# Altium schematic sheet Charging&1AOut2.SchDoc
size A; DocumentNumber: 5; SheetNumber: 5; SheetTotal: 7
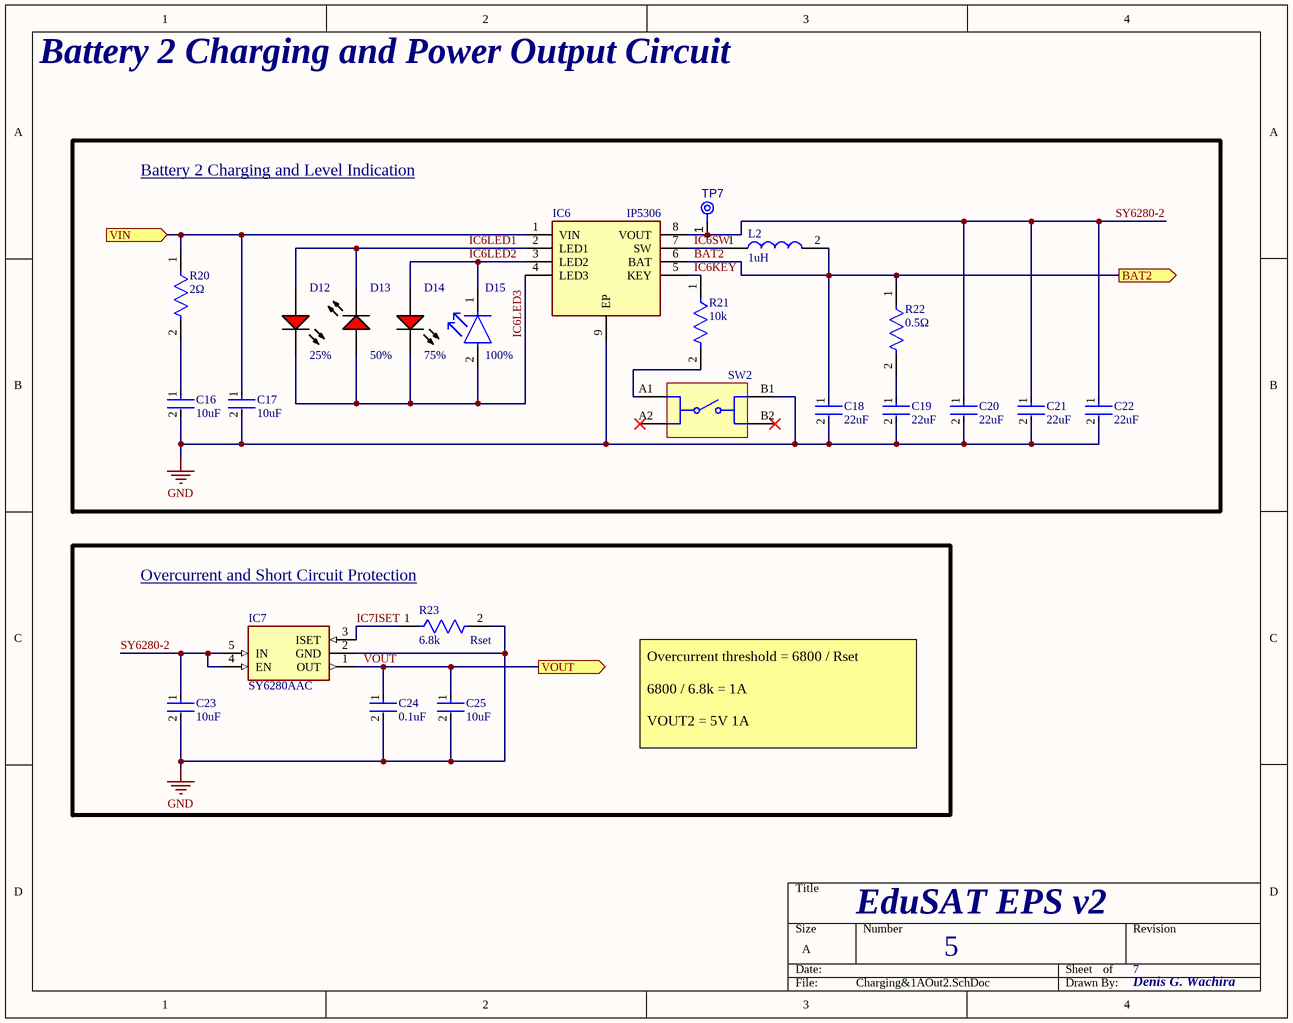
[diagram p0: Charging&1AOut2.SchDoc]

## Parts
C16  10uF  [FP-CL21-IPC_A]
C17  10uF  [FP-CL21-IPC_A]
C18  22uF  [FP-CL21-IPC_C]
C19  22uF  [FP-CL21-IPC_C]
C20  22uF  [FP-CL21-IPC_C]
C21  22uF  [FP-CL21-IPC_C]
C22  22uF  [FP-CL21-IPC_C]
C23  10uF  [FP-CL21-IPC_A]
C24  0.1uF  [FP-CL21-IPC_A]
C25  10uF  [FP-CL21-IPC_A]
D12  25%  [LTST-C170KRKT_V]
D13  50%  [LTST-C170KRKT_V]
D14  75%  [LTST-C170KRKT_V]
D15  100%  [FP-LTST-C170GKT-MFG]
IC6  IP5306  [SOIC127P600X165-9N]
IC7  SY6280AAC  [SOT95P285X140-5N]
L2  1uH  [INDPM7366X300N]
R20  2Ω  [FP-CR0805-IPC_B]
R21  10k  [FP-MCR10-IPC_C]
R22  0.5Ω  [FP-MCR10-IPC_C]
R23  6.8k          Rset  [FP-MCR10-IPC_C]
SW2  430181038816  [WS-TASV_L4.5W4.5H3.8_430181038816]  (value not drawn)
TP7  TPAD6R  [TP06R]  (value not drawn)  (no BOM)

## Blocks framed on the sheet
Battery 2 Charging and Level Indication: C16-C22 D12-D15 IC6 L2 R20-R22 SW2 TP7
Overcurrent and Short Circuit Protection: C23-C25 IC7 R23

## Ports
BAT2 (out, see EduSAT-EPSv2[3C], BatteryConn&Protection[3B]), VIN (in, see EduSAT-EPSv2[2B], Charging&1AOut1[1A], Charging&1AOut3[1A], PowerInput&Switch[4C]), VOUT (out, see EduSAT-EPSv2[3B], Charging&1AOut1[2C], Charging&1AOut3[2C], PowerOutput&Switch[1A])

## Nets
GND: C16.2 C17.2 C18.2 C19.2 C20.2 C21.2 C22.2 C23.2 C24.2 C25.2 IC6.9(EP) IC7.2(GND) R23.2 SW2.B1
BAT2: C18.1 IC6.6(BAT) L2.2 R22.1 ; port BAT2
IC6KEY: IC6.5(KEY) R21.1
IC6LED1: D12.1(A) D13.2(K) IC6.2(LED1)
IC6LED2: D14.1(A) D15.1(C) IC6.3(LED2)
IC6LED3: D12.2(K) D13.1(A) D14.2(K) D15.2(A) IC6.4(LED3)
IC6SW: IC6.7(SW) L2.1
IC7ISET: IC7.3(ISET) R23.1
SY6280-2: C20.1 C21.1 C22.1 C23.1 IC6.8(VOUT) IC7.4(EN) IC7.5(IN) TP7.1(TP)
VIN: C17.1 IC6.1(VIN) R20.1 ; port VIN
VOUT: C24.1 C25.1 IC7.1(OUT) ; port VOUT
NetC16_1: C16.1 R20.2
NetC19_1: C19.1 R22.2
NetR21_2: R21.2 SW2.A1

Not connected (* = marked no-connect by the designer): SW2 A2* B2*

## Notes on the sheet
- Battery 2 Charging and Power Output Circuit
- Overcurrent threshold = 6800 / Rset
  6800 / 6.8k = 1A
  VOUT2 = 5V 1A
- EduSAT EPS v2
- Denis G. Wachira

## Library data of the parts
C16 C17 C23 C25 = CMP-13271-002975-1: CL21 Series 0805 10uF 25V ±10% Tolerance X5R Multilayer Ceramic Chip Capacitor CL21A106KAYNNNE; Case Code (Imperial): 0805; Length: 2mm; Case/Package: 0805; Packaging: Tape and Reel; Width: 0.049inch; Tolerance: 10%; Mount: Surface Mount; Min Operating Temperature: -55°C; Thickness: 0.057inch; Height: 1.25mm; Dielectric: X5R; Package Quantity: 1; Depth: 1.25mm; Capacitance: 10uF; Voltage Rating: 25V; Case Code (Metric): 2012; Max Operating Temperature: 85°C; Radiation Hardening: No
C18-C22 = CMP-13271-003225-1: CL21 Series 0805 22uF 25V ±20% Tolerance X5R Multilayer Ceramic Chip Capacitor CL21A226MAYNNNE
C24 = CMP-13271-002975-1: 50V 0.1uF X7R ±10% 0805 Multilayer Ceramic Capacitors MLCC - SMD/SMT ROHS TCC0805X7R104K500DT; Case Code (Imperial): 0805; Length: 2mm; Case/Package: 0805; Packaging: Tape and Reel; Width: 0.049inch; Tolerance: 10%; Mount: Surface Mount; Min Operating Temperature: -55°C; Thickness: 0.057inch; Height: 1.25mm; Dielectric: X7R; Package Quantity: 1; Depth: 1.25mm; Capacitance: 0.1uF; Voltage Rating: 50V; Case Code (Metric): 2012; Max Operating Temperature: 85°C; Radiation Hardening: No
D12 = CMP-2000-07593-1: LED Red,KT-0805R; Manufacturer: Lite-On; Lens Transparency: Clear; Number of Elements: 1; Power Rating: 75mW; Luminous Intensity: 54mcd; Viewing Angle: 130degrees; Forward Current: 30mA; Wavelength: 639nm; Lens Style: Rectangular; Case\/Package: 0805; Test Current: 20mA; Dominant Wavelength: 631nm; Forward Voltage: 2V; Lens Colour: Colorless; Min Operating Temperature: -55degC; RoHSCompliant: True; Length: 3.2mm; Width: 1.25mm; Mount: SurfaceMount; Packaging: TapeandReel; Number of LEDs: 1; Radiation Hardening: No; Datasheet URL: http://optoelectronics.liteon.com/upload/download/DS-22-99-0150/LTST-C170KRKT.pdf; Datasheet Version: Rev. D, 11/2014; Case Code (Metric): 2012; Height: 1.1mm; Number of Pins: 2; Package Description: 2-Pin Surface Mount Device, Body 2 x 1.25 mm; Manufacturer URL: http://www.us.liteon.com/; Lead Free: LeadFree; Illumination Colour: Red; Colour: Red; Case Code (Imperial): 0805; Max Operating Temperature: 85degC; Power Dissipation: 75mW; Mounting Technology: SurfaceMount; Package Reference: C170KRKT; Package Quantity: 1; Depth: 1.6mm
D13 D14 = CMP-2000-07593-1: LED Red, KT-0805R; Manufacturer: Lite-On; Lens Transparency: Clear; Number of Elements: 1; Power Rating: 75mW; Luminous Intensity: 54mcd; Viewing Angle: 130degrees; Forward Current: 30mA; Wavelength: 639nm; Lens Style: Rectangular; Case\/Package: 0805; Test Current: 20mA; Dominant Wavelength: 631nm; Forward Voltage: 2V; Lens Colour: Colorless; Min Operating Temperature: -55degC; RoHSCompliant: True; Length: 3.2mm; Width: 1.25mm; Mount: SurfaceMount; Packaging: TapeandReel; Number of LEDs: 1; Radiation Hardening: No; Datasheet URL: http://optoelectronics.liteon.com/upload/download/DS-22-99-0150/LTST-C170KRKT.pdf; Datasheet Version: Rev. D, 11/2014; Case Code (Metric): 2012; Height: 1.1mm; Number of Pins: 2; Package Description: 2-Pin Surface Mount Device, Body 2 x 1.25 mm; Manufacturer URL: http://www.us.liteon.com/; Lead Free: LeadFree; Illumination Colour: Red; Colour: Red; Case Code (Imperial): 0805; Max Operating Temperature: 85degC; Power Dissipation: 75mW; Mounting Technology: SurfaceMount; Package Reference: C170KRKT; Package Quantity: 1; Depth: 1.6mm
D15 = CMP-1674-00002-6: LED GREEN CLEAR SMD KT-0805G; Dominant Wavelength: 569nm; Lens Style: Diffused; Forward Voltage: 2.1V; Number of Elements: 1; Wavelength: 565nm; Luminous Intensity: 6mcd; Test Current: 10mA; Power Dissipation: 100mW; Reverse Voltage: 5V; Forward Current: 30mA; Viewing Angle: 130°; Lens Color: Colorless; Min Operating Temperature: -55°C; Number of Pins: 2; Max Operating Temperature: 85°C; Color: Green; Radiation Hardening: No; Illumination Color: Green; Case Code (Metric): 2012; Lens Transparency: Clear; Case/Package: 0805; Width: 1.25mm; Case Code (Imperial): 0805; Package Quantity: 1; Height: 1.1mm; Depth: 1.25mm; Length: 2mm; Power Rating: 100mW; Lead Free: Lead Free; Number of LEDs: 1; Packaging: Tape and Reel; Mount: Surface Mount; Voltage: 5V
IC6 = IP5306: Integrated Circuit; Manufacturer_Name: INJOINIC; Datasheet Link: https://datasheetspdf.com/pdf-file/1139129/Injoinic/IP5306/1; Height: 1.65mm; Manufacturer_Part_Number: IP5306
IC7 = SY6280AAC: Integrated Circuit; Manufacturer_Name: Silergy; Datasheet Link: https://datasheet.lcsc.com/szlcsc/Silergy-Corp-SY6280AAC_C55136.pdf; Height: 1.4mm; Manufacturer_Part_Number: SY6280AAC
L2 = MCS0630-2R2MN2: Inductor MCS0630-1R0MN2; Manufacturer_Name: Prosperity Dielectrics; Height: 3mm; Manufacturer_Part_Number: MCS0630-1R0MN2
R20 = CMP-07231-004400-1: Thick Film Chip Resistors 0805 2Ω 0.125W 1% 250ppm/°C / RS-05L2R00FT; Power Rating: 125mW; Voltage Rating: 150V; Packaging: Tape and Reel; Thickness: 508um; Case Code (Metric): 2012; Military Standard: Not; Height: 0.5mm; Depth: 1.25mm; Weight: 0.000194oz; Length: 2mm; Resistance: 2Ω; Min Operating Temperature: -55°C; Radiation Hardening: No; Case/Package: 0805; Tolerance: 1%; Mount: Surface Mount; Width: 1.25mm; Max Operating Temperature: 155°C; Contact Plating: Tin; Temperature Coefficient: 250ppm/°C; Case Code (Imperial): 0805; Composition: Thick Film; Termination: SMD/SMT
R21 = CMP-08839-012433-1: Thick Film Chip Resistor, 0805, 10kΩ, 1%, 100ppm/°C, 0.125W, 150V / 0805W8F1002T5E; Resistance: 10kR; Power Rating: 125mW; Resistor Type: Thick Film; Contact Plating: Tin; Length: 2mm; Tolerance: 1%; Temperature Coefficient: 100ppm/°C; Max Operating Temperature: 155°C; Min Operating Temperature: -55°C; Height: 550um; Voltage Rating (DC): 150V; Mount: Surface Mount; Case/Package: 0805; Lead Free: Lead Free; Width: 1.25mm; Radiation Hardening: No; Working Voltage: 150V; Number of Terminations: 2
R22 = CMP-08839-012433-1: Thick Film Chip Resistor, 0805, 0.5R, 1%, 100ppm/°C, 0.125W, 150V / 0805W8F500LT5E; Resistance: 10kR; Power Rating: 125mW; Resistor Type: Thick Film; Contact Plating: Tin; Length: 2mm; Tolerance: 1%; Temperature Coefficient: 100ppm/°C; Max Operating Temperature: 155°C; Min Operating Temperature: -55°C; Height: 550um; Voltage Rating (DC): 150V; Mount: Surface Mount; Case/Package: 0805; Lead Free: Lead Free; Width: 1.25mm; Radiation Hardening: No; Working Voltage: 150V; Number of Terminations: 2
R23 = CMP-08839-012433-1: Thick Film Chip Resistor, 0805, 6.8kΩ, 1%, 100ppm/°C, 0.125W, 150V / 0805W8F6801T5E; Resistance: 10kR; Power Rating: 125mW; Resistor Type: Thick Film; Contact Plating: Tin; Length: 2mm; Tolerance: 1%; Temperature Coefficient: 100ppm/°C; Max Operating Temperature: 155°C; Min Operating Temperature: -55°C; Height: 550um; Voltage Rating (DC): 150V; Mount: Surface Mount; Case/Package: 0805; Lead Free: Lead Free; Width: 1.25mm; Radiation Hardening: No; Working Voltage: 150V; Number of Terminations: 2
SW2 = CMP-1454-00001-2: 4.5mm 3.5mm 50mA Round Button Brick nogging 4.5mm 260gf 12V SMD Tactile Switches ROHS / TSC015A03526A; NexarPartId: 57114477; Switch Function: Off-Mom; Actuator Material: Liquid Crystal Polymer, Polymer; Insulation Resistance: 100MΩ; Throw Configuration: SPST; Switch Travel: 200µm; Illumination Type: Non-Illuminated; Mechanical Life: 1Mcycles; Current Rating: 50mA; RoHS: Compliant; Termination: SMD/SMT; Packaging: Tape and Reel; Height: 3.8mm; Mount: Surface Mount; Max Operating Temperature: 85°C; Voltage Rating: 12V; Contact Plating: Silver; Min Operating Temperature: -40°C
TP7 = CMP-00028-00002-2: 0.6mm round; Pins: 1